# Altium schematic sheet USB-Serial.SchDoc: USB-Serial
size Letter; SheetNumber: 4; SheetTotal: 11
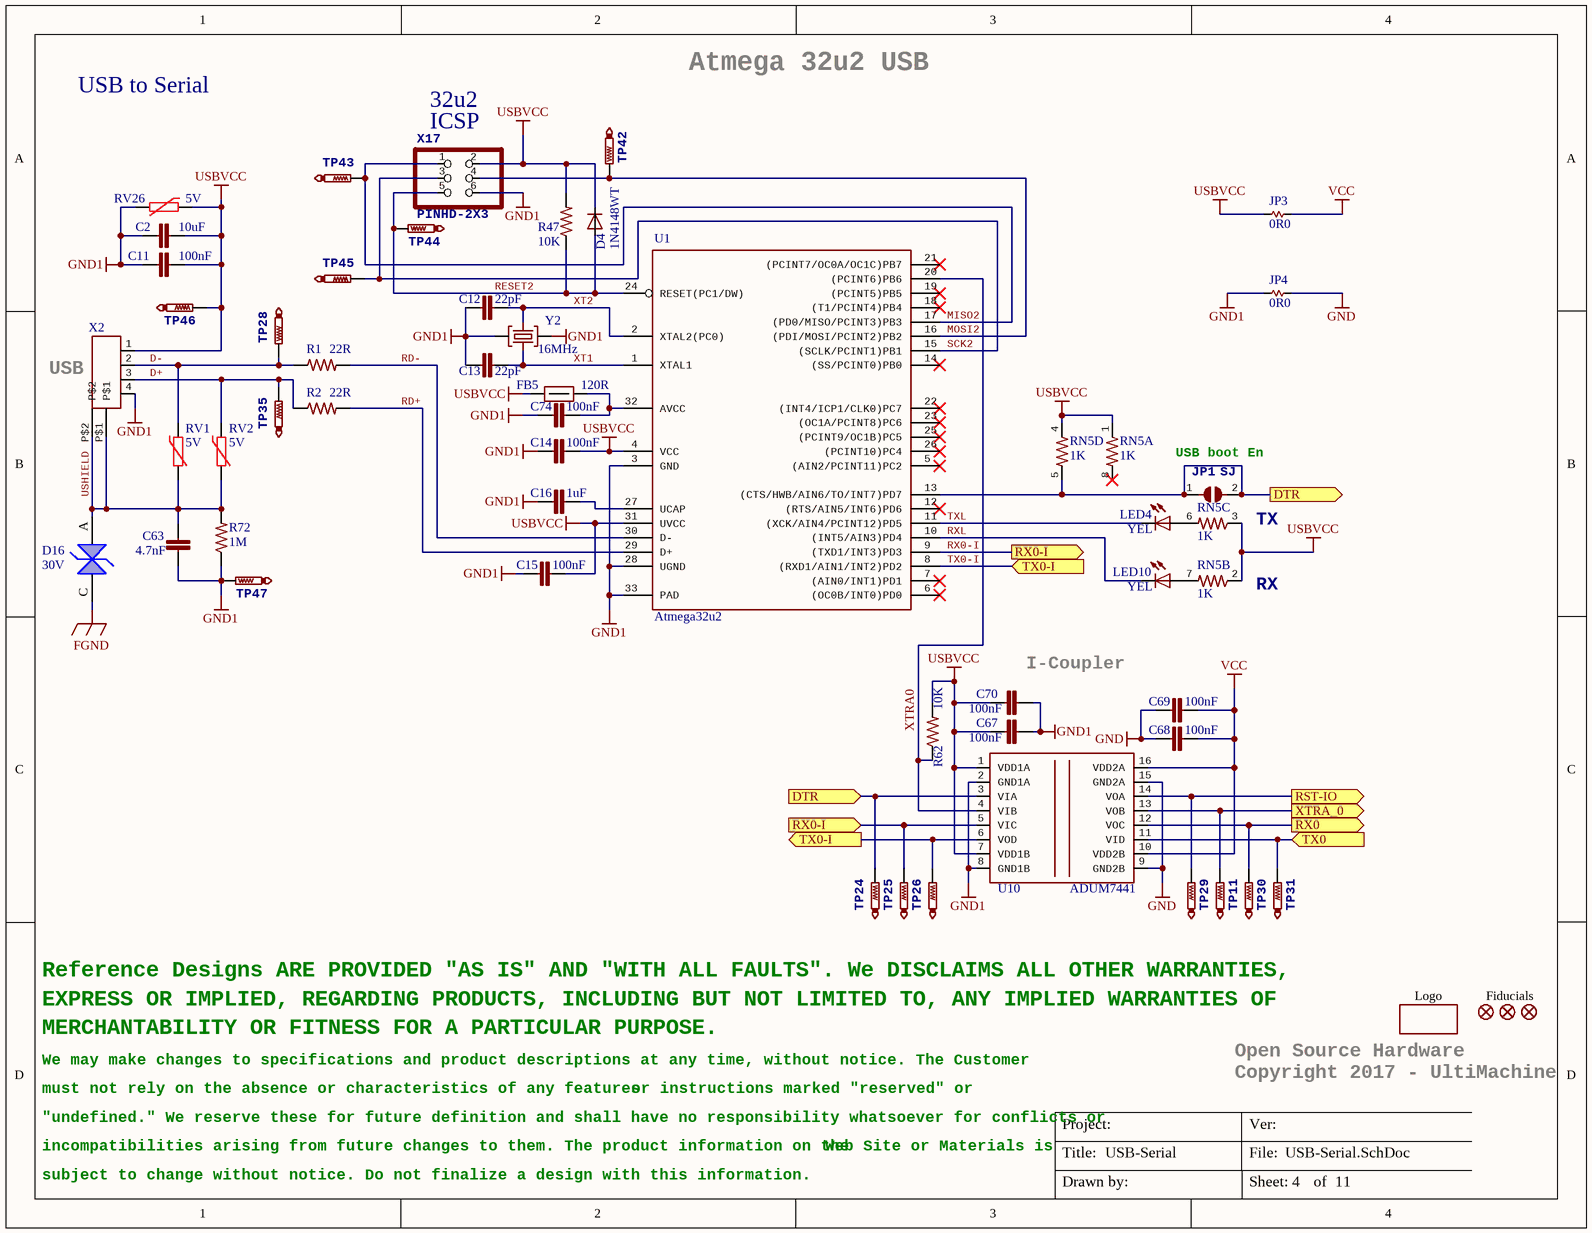
[diagram p0: USB-Serial.SchDoc]

## Parts
C2  10uF  [C0805]
C11  100nF  [C0402]
C12  22pF  [C0402]
C13  22pF  [C0402]
C14  100nF  [C0402]
C15  100nF  [C0402]
C16  1uF  [C0402]
C63  4.7nF  [C0402]
C67  100nF  [C0402]
C68  100nF  [C0402]
C69  100nF  [C0402]
C70  100nF  [C0402]
C74  100nF  [C0402]
D4  1N4148WT  [SOD523]
D16  value 30V  [SOD323-R]  (hidden comment: RSB39VTE-17)
FB5  120R  [FB0603]
FID1  FIDUCIAL  [FIDUCIAL-1X2]  (value not drawn)
FID2  FIDUCIAL  [FIDUCIAL-1X2]  (value not drawn)
FID3  FIDUCIAL  [FIDUCIAL-1X2]  (value not drawn)
JP1  SJ  [SJ]  (no BOM)
JP3  0R0  [R0805]
JP4  0R0  [R0805]
LED4  YEL  [LED2012120]
LED10  YEL  [LED2012120]
LOGO1  OSHW_LOGO_8MILX0150-NT  [OSHW_8X150_NOTEXT]  (value not drawn)  (no BOM)
R1  22R  [R0402]
R2  22R  [R0402]
R47  10K  [R0402]
R62  10K  [R0402]
R72  1M  [R0402]
RN5  1K  [CAY16]  (parts A,B,C,D of 4)
RV1  value 5V  [R0603]  (hidden comment: CG0603MLC-05E)
RV2  value 5V  [R0603]  (hidden comment: CG0603MLC-05E)
RV26  value 5V  [R0603]  (hidden comment: CG0603MLC-05E)
TP11  TestPoint  [TP1-27]  (value not drawn)  (no BOM)
TP24  TestPoint  [TP1-27]  (value not drawn)  (no BOM)
TP25  TestPoint  [TP1-27]  (value not drawn)  (no BOM)
TP26  TestPoint  [TP1-27]  (value not drawn)  (no BOM)
TP28  TestPoint  [TP1-27]  (value not drawn)  (no BOM)
TP29  TestPoint  [TP1-27]  (value not drawn)  (no BOM)
TP30  TestPoint  [TP1-27]  (value not drawn)  (no BOM)
TP31  TestPoint  [TP1-27]  (value not drawn)  (no BOM)
TP35  TestPoint  [TP1-27]  (value not drawn)  (no BOM)
TP42  TestPoint  [TP1-27]  (value not drawn)  (no BOM)
TP43  TestPoint  [TP1-27]  (value not drawn)  (no BOM)
TP44  TestPoint  [TP1-27]  (value not drawn)  (no BOM)
TP45  TestPoint  [TP1-27]  (value not drawn)  (no BOM)
TP46  TestPoint  [TP1-27]  (value not drawn)  (no BOM)
TP47  TestPoint  [TP1-27]  (value not drawn)  (no BOM)
U1  Atmega32u2  [QFN32_DualSolderMask]
U10  ADUM7441  [QSOP16]
X2  USB-B  [PN61729]  (value not drawn)
X17  PINHD-2X3  [2X03]
Y2  value 16MHz  [CRYS320250]  (hidden comment: 7M-16.000MEEQ-T)

## Ports
DTR, RST-IO, RX0, RX0-I, TX0, TX0-I, XTRA_0

## Nets
FGND: D16.C
GND: C68.1 C69.2 JP4.2 U10.9(GND2B) U10.15(GND2A)
GND1: C2.1 C11.2 C12.2 C13.2 C14.2 C15.2 C16.2 C63.2 C67.1 C70.2 C74.2 JP4.1 R72.1 RV26.1 TP47.TP U1.3(GND) U1.28(UGND) U1.33(PAD) U10.2(GND1A) U10.8(GND1B) X2.4 X17.6 Y2.2(GND) Y2.4(GND)
USBVCC: C2.2 C11.1 C14.1 C15.1 C67.2 C70.1 D4.C FB5.1 JP3.1 R47.2 R62.2 RN5.1 RN5.2 RN5.3 RN5.4 RV26.2 TP46.TP U1.4(VCC) U1.31(UVCC) U10.1(VDD1A) U10.7(VDD1B) X2.1 X17.2
VCC: C68.2 C69.1 JP3.2 U10.10(VDD2B) U10.16(VDD2A)
D+: R2.1 RV2.2 TP35.TP X2.3
D-: R1.1 RV1.2 TP28.TP X2.2
DTR: JP1.1 JP1.2 RN5.5 TP24.TP U1.13((CTS/HWB/AIN6/TO/INT7)PD7) U10.3(VIA) ; port DTR
MISO2: TP43.TP U1.17((PD0/MISO/PCINT3)PB3) X17.1
MOSI2: TP42.TP U1.16((PDI/MOSI/PCINT2)PB2) X17.4
RD+: R2.2 U1.29(D+)
RD-: R1.2 U1.30(D-)
RESET2: D4.A R47.1 TP44.TP U1.24(RESET(PC1/DW)) X17.5
RST-IO: TP29.TP U10.14(VOA) ; port RST-IO
RX0: TP30.TP U10.12(VOC) ; port RX0
RX0-I: TP25.TP U1.9((TXD1/INT3)PD3) U10.5(VIC) ; port RX0-I
RXL: LED10.C U1.10((INT5/AIN3)PD4)
SCK2: TP45.TP U1.15((SCLK/PCINT1)PB1) X17.3
TX0: TP31.TP U10.11(VID) ; port TX0
TX0-I: TP26.TP U1.8((RXD1/AIN1/INT2)PD2) U10.6(VOD) ; port TX0-I
TXL: LED4.C U1.11((XCK/AIN4/PCINT12)PD5)
USHIELD: C63.1 D16.A R72.2 RV1.1 RV2.1 X2.P$1 X2.P$2
XT1: C13.1 U1.1(XTAL1) Y2.1(C1)
XT2: C12.1 U1.2(XTAL2(PC0)) Y2.3(C2)
XTRA0: R62.1 U1.20((PCINT6)PB6) U10.4(VIB)
XTRA_0: TP11.TP U10.13(VOB) ; port XTRA_0
NetC16_1: C16.1 U1.27(UCAP)
NetC74_1: C74.1 FB5.2 U1.32(AVCC)
NetLED4_A: LED4.A RN5.6
NetLED10_A: LED10.A RN5.7

Not connected (* = marked no-connect by the designer): RN5 8(2)*; U1 5((AIN2/PCINT11)PC2)* 6((OC0B/INT0)PD0)* 7((AIN0/INT1)PD1)* 12((RTS/AIN5/INT6)PD6)* 14((SS/PCINT0)PB0)* 18((T1/PCINT4)PB4)* 19((PCINT5)PB5)* 21((PCINT7/OC0A/OC1C)PB7)* 22((INT4/ICP1/CLK0)PC7)* 23((OC1A/PCINT8)PC6)* 25((PCINT9/OC1B)PC5)* 26((PCINT10)PC4)*

## Notes on the sheet
- USB to Serial
- (near X17) 32u2
- Atmega 32u2 USB
- (near X17) ICSP
- (near X2) USB
- (near JP1) USB boot En
- TX
- (near RN5) RX
- (near C70) I-Coupler
- Reference Designs ARE PROVIDED "AS IS" AND "WITH ALL FAULTS". We DISCLAIMS ALL OTHER WARRANTIES,
- MERCHANTABILITY OR FITNESS FOR A PARTICULAR PURPOSE.
- EXPRESS OR IMPLIED, REGARDING PRODUCTS, INCLUDING BUT NOT LIMITED TO, ANY IMPLIED WARRANTIES OF
- (near LOGO1) Logo
- Fiducials
- must not rely on the absence or characteristics of any features
- We may make changes to specifications and product descriptions at any time, without notice. The Customer
- or instructions marked "reserved" or
- Copyright 2017 - UltiMachine
- (near LOGO1) Open Source Hardware
- incompatibilities arising from future changes to them. The product information on the
- "undefined." We reserve these for future definition and shall have no responsibility whatsoever for conflicts or
- subject to change without notice. Do not finalize a design with this information.
- Web Site or Materials is
- Title:
- Project:
- File:
- Ver:
- Drawn by:
- Sheet:
- of

## Library data of the parts
C2 = C0805C106K8PACTU: CAP CER 0805 10uF 10V 10% X5R; Manufacturer: Kemet; Part Description: 10µF ±10% 10V Ceramic Capacitor X5R 0805 (2012 Metric); EE_SPEC: 10uF 10V X5R 0805; Tolerance: +/- 10%; VALUE: 10uF; MANUFACTURER #: C0805C106K8PACTU; DISTRIBUTOR #: 399-4925-2-ND; DISTRIBUTOR: Digi-Key; PART: 10uF
C11 C14 C15 C67-C70 C74 = GRM155R71C104KA88D: CAP CER 0402 100nF 16V 10% X7R; Manufacturer: Murata; Part Description: 0.10µF ±10% 16V Ceramic Capacitor X7R 0402 (1005 Metric); EE_SPEC: 100nF 16V X7R 0402; Tolerance: +/- 10%; VALUE: 100nF; MANUFACTURER #: GRM155R71C104KA88D; DISTRIBUTOR #: 490-3261-2-ND; DISTRIBUTOR: Digi-Key; PART: 100nF
C12 C13 = 04025A220JAT2A: CAP CER 0402 22pF 50V 5% C0G; Manufacturer: AVX; Part Description: 22pF ±5% 50V Ceramic Capacitor C0G, NP0 0402 (1005 Metric); EE_SPEC: 22pF 5% 50V NP0 0402; VALUE: 22pF; MANUFACTURER #: 04025A220JAT2A; DISTRIBUTOR #: 478-1074-2-ND; DISTRIBUTOR: Digi-Key; PART: 22pF 50V; Tolerance: 5%
C16 = GRM155R60J105KE19D: CAP CER 0402 1uF 6.3V 10% X5R; Manufacturer: Murata; Part Description: 1µF ±10% 6.3V Ceramic Capacitor X5R 0402 (1005 Metric); EE_SPEC: 1uF 6.3V X5R 0402; Tolerance: +/- 10%; VALUE: 1uF; MANUFACTURER #: GRM155R60J105KE19D; DISTRIBUTOR #: 490-1320-2-ND; DISTRIBUTOR: Digi-Key; PART: 1uF
C63 = CC0402KRX7R8BB472: CAP CER 0402 4.7nF 25V 10% X7R; Manufacturer: YAGEO; Part Description: 4700pF ±10% 25V Ceramic Capacitor X7R 0402 (1005 Metric); EE_SPEC: 4.7nF 25V X7R 0402; Tolerance: +/- 10%; VALUE: 4.7nF; MANUFACTURER #: CC0402KRX7R8BB472; DISTRIBUTOR #: 311-1039-2-ND; DISTRIBUTOR: Digi-Key; PART: 4.7nF
D4 = 1N4148WT: DIODE SOD523; Manufacturer: Fairchild; Part Description: DIODE GEN PURP 75V 200MA SOD523F; EE_SPEC: 75V 0.2A; Tolerance: NA; Value: 1N4148WT; DISTRIBUTOR #: 1N4148WTTR-ND; DISTRIBUTOR: Digi-Key; MANUFACTURER #: 1N4148WT; PART: 1N4148WT
D16 = RSB39VTE-17: DIODE TVS; Manufacturer: Rohm; Part Description: TVS DIODE 30VWM SOD323; EE_SPEC: 30Vrs 35.1Vbd 30pF; Tolerance: NA; MANUFACTURER #: RSB39VTE-17; DISTRIBUTOR #: RSB39VTE-17TR-ND; DISTRIBUTOR: Digi-Key; PART: 30V
FB5 = FERRITE 120R 3A 0603: FERRITE BEAD 120 OHM 0603 1LN; MANUFACTURER: Samsung; MANUFACTURER #: CIS10P121AC; VALUE: 120Rfb; TOLERANCE: -NA-; EE_SPEC: 3A; DISTRIBUTOR #: 1276-6351-2-ND; DISTRIBUTOR: DigiKey; PART: FERRITE 120R 3A 0603; PART DESCRIPTION: FERRITE BEAD 120 OHM 0603 1LN
JP1 = SJ: SMD solder jumper
JP3 JP4 = 0R0 1% 0805: RES 0.0 OHM 1/8W JUMP 0805 SMD; MANUFACTURER: STACKPOLE; MANUFACTURER #: RMCF0805ZT0R00; PART DESCRIPTION: 0 Ohms Jumper 0.125W, 1/8W Chip Resistor 0805 (2012 Metric) Automotive AEC-Q200 Thick Film; TOLERANCE: 1%; EE_SPEC: 0.125W; PART: 0R0; DISTRIBUTOR: Digi-Key; DISTRIBUTOR #: RMCF0805ZT0R00CT-ND; VALUE: 0R0
LED4 LED10 = 5988140107F: LED 0805 Yellow; Manufacturer: Dialight; Part Description: Yellow 593nm LED Indication - Discrete 2V 0805 (2012 Metric); EE_SPEC: 2V 0.02A; Tolerance: NA; VALUE: YEL; MANUFACTURER #: 5988140107F; DISTRIBUTOR #: 350-2041-2-ND; DISTRIBUTOR: Digi-Key; PART: YEL
R1 R2 = RC0402FR-0722RL: RES 0402 22r 62.5mW 1%; Manufacturer: Yageo; Part Description: 22 Ohm ±1% 0.063W, 1/16W Chip Resistor 0402 (1005 Metric) Moisture Resistant Thick Film; EE_SPEC: 22R 1% 0402; Tolerance: +/- 1%; VALUE: 22R; DISTRIBUTOR #: 311-22.0LRTR-ND; DISTRIBUTOR: Digi-Key; MANUFACTURER #: RC0402FR-0722RL; PART: 22R
R47 R62 = RC0402FR-0710KP: RES SMD 10K OHM 1% 1/16W 0402; MANUFACTURER: Yageo; PART: 10k 1% 0402; PART DESCRIPTION: 10k Ohm ±1% 0.063W, 1/16W Chip Resistor 0402 (1005 Metric) Moisture Resistant Thick Film; EE_SPEC: 10k 1% 0402 1/16W; VALUE: 10K; MANUFACTURER #: RC0402FR-0710KP; DISTRIBUTOR #: YAG1249TR-ND; DISTRIBUTOR: Digi-Key; TOLERANCE: 1%
R72 = ERJ2GEJ105X: RES 0402 1M 100mW 5%; Manufacturer: Panasonic; Part Description: 1M Ohm ±5% 0.1W, 1/10W Chip Resistor 0402 (1005 Metric) Automotive AEC-Q200 Thick Film; EE_SPEC: 1M 1% 0402; Tolerance: +/- 1%; VALUE: 1M; MANUFACTURER #: ERJ2GEJ105X; DISTRIBUTOR #: P1.0MJTR-ND; DISTRIBUTOR: Digi-Key; PART: 1M
RN5 = CAY16-102J4LF: RES ARRAY 4 RES 1K 1206 62.5mW 5%; Manufacturer: Bourns; Part Description: 1k Ohm ±5% 62.5mW Power Per Element Isolated Resistor Network/Array ±200ppm/°C 1206 (3216 Metric), Convex, Long Side Terminals; EE_SPEC: 1k 5% Array_x_4; Tolerance: +/- 5%; VALUE: 1K; MANUFACTURER #: CAY16-102J4LF; DISTRIBUTOR #: CAY16-102J4LFTR-ND; DISTRIBUTOR: Digi-Key; PART: 1K
RV1 RV2 RV26 = CG0603MLC-05E: VAR 0603 5V; Manufacturer: YAGEO; EE_SPEC: 5VDC; Tolerance: NA; MANUFACTURER #: CG0603MLC-05E; DISTRIBUTOR #: CG0603MLC-05ETR-ND; DISTRIBUTOR: Digi-Key; PART: 5VDC; Part Description: VARISTOR 0603
TP11 TP24-TP26 TP28-TP31 TP35 TP42-TP47 = TestPoint: Test Point
U1 = ATMEGA32U2-DualSolderMask: Manufacturer: Microchip; MANUFACTURER #: ATMEGA32U2-MUR; Part Description: AVR AVR® ATmega Microcontroller IC 8-Bit 16MHz 32KB (16K x 16) FLASH 32-VQFN (5x5); EE_SPEC: 5V 32KB 1KB; Tolerance: NA; DISTRIBUTOR #: ATMEGA32U2-MURTR-ND; DISTRIBUTOR: Digi-Key; PART: ATMEGA32U2; VALUE: ATMEGA32U2
U10 = ADUM7441: 4ch iCoupler; Manufacturer: Analog Devices; MANUFACTURER #: ADUM7441ARQZ-RL7; PART: ADUM7441ARQZ; Part Description: General Purpose Digital Isolator 1000Vrms 4 Channel 1Mbps 15kV/µs CMTI 16-SSOP (0.154", 3.90mm Width); EE_SPEC: 5V 1000Viso; Tolerance: NA; VALUE: ADUM7441ARQZ; DISTRIBUTOR #: ADUM7441ARQZ-RL7TR-ND; DISTRIBUTOR: Digi-Key
X2 = USB-B: USB connector B PTH; Manufacturer: FCI; MANUFACTURER #: 61729-0010BLF; Part Description: USB - B USB 2.0 Receptacle Connector 4 Position Through Hole, Right Angle; EE_SPEC: USB-B T-Hole R/A; Tolerance: NA; DISTRIBUTOR #: 609-1039-ND; DISTRIBUTOR: Digi-Key; PART: USB-B; VALUE: USB-B
X17 = PINHD-2X3: CONN HEADER VERT 6POS GOLD; Manufacturer: MultiComp; MANUFACTURER #: 2213S-06G; PART: 6PIN; Part Description: 6 Positions Header Connector 0.100" (2.54mm) Through Hole Gold; EE_SPEC: 10Pin 2Row 0.1" T-Hole; Tolerance: NA; VALUE: 6PIN; DISTRIBUTOR #: 08N6789; DISTRIBUTOR: Newark
Y2 = 7M-16.000MEEQ-T: Crystal 16mHz 10ppm 10pF; Manufacturer: TXC; Part Description: CRYSTAL 16.0000MHZ 10PF SMD; EE_SPEC: 10ppm 10pF 80R; MANUFACTURER #: 7M-16.000MEEQ-T; DISTRIBUTOR #: 887-1319-2-ND; DISTRIBUTOR: Digi-Key; PART: 16MHz; Tolerance: 10ppm